# Altium schematic sheet connectors-external-old.SchDoc
size A3; DocumentNumber: 11; SheetNumber: 11; SheetTotal: 45; SheetDescription: Connectors (external)
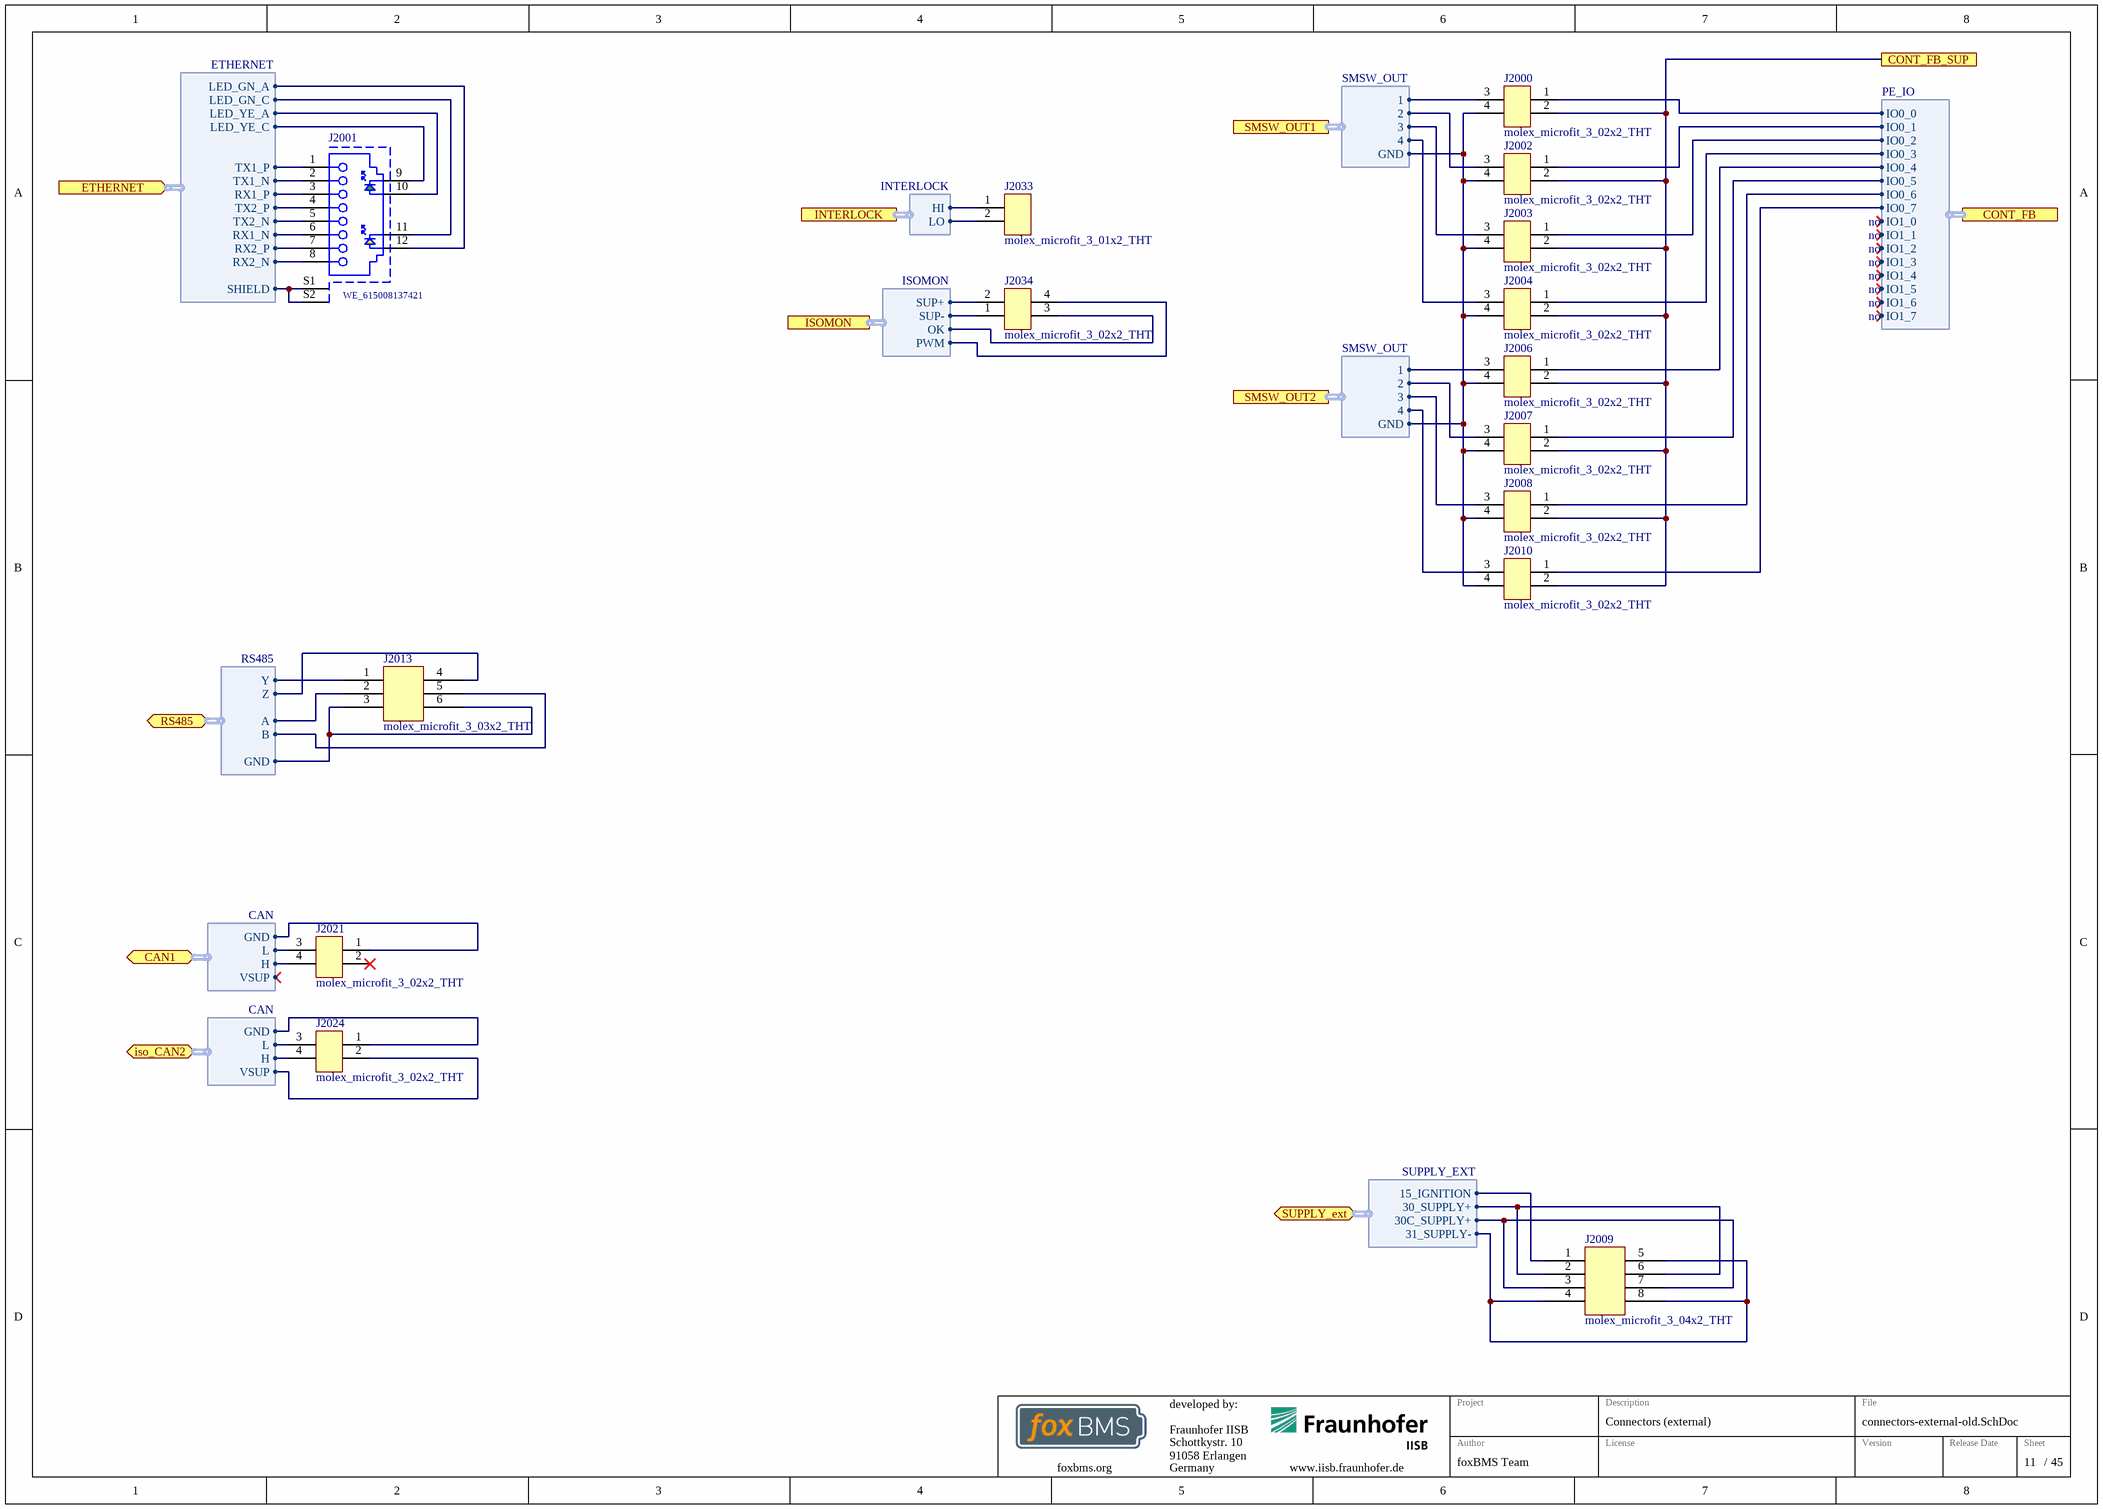
[diagram p0: connectors-external-old.SchDoc]

## Parts
J2000  molex_microfit_3_02x2_THT  [MOLEX_MICROFIT_02x2_THT]
J2001  WE_615008137421  [WE_615008137421]
J2002  molex_microfit_3_02x2_THT  [MOLEX_MICROFIT_02x2_THT]
J2003  molex_microfit_3_02x2_THT  [MOLEX_MICROFIT_02x2_THT]
J2004  molex_microfit_3_02x2_THT  [MOLEX_MICROFIT_02x2_THT]
J2006  molex_microfit_3_02x2_THT  [MOLEX_MICROFIT_02x2_THT]
J2007  molex_microfit_3_02x2_THT  [MOLEX_MICROFIT_02x2_THT]
J2008  molex_microfit_3_02x2_THT  [MOLEX_MICROFIT_02x2_THT]
J2009  molex_microfit_3_04x2_THT  [MOLEX_MICROFIT_04x2_THT]
J2010  molex_microfit_3_02x2_THT  [MOLEX_MICROFIT_02x2_THT]
J2013  molex_microfit_3_03x2_THT  [MOLEX_MICROFIT_03x2_THT]
J2021  molex_microfit_3_02x2_THT  [MOLEX_MICROFIT_02x2_THT]
J2024  molex_microfit_3_02x2_THT  [MOLEX_MICROFIT_02x2_THT]
J2033  molex_microfit_3_01x2_THT  [MOLEX_MICROFIT_01x2_THT]
J2034  molex_microfit_3_02x2_THT  [MOLEX_MICROFIT_02x2_THT]

## Ports
CAN1 (bidir, harness CAN), CONT_FB (harness PE_IO), CONT_FB_SUP, ETHERNET (in, harness ETHERNET), INTERLOCK (harness INTERLOCK), iso_CAN2 (bidir, harness CAN), ISOMON (harness ISOMON), RS485 (bidir, harness RS485), SMSW_OUT1 (harness SMSW_OUT), SMSW_OUT2 (harness SMSW_OUT), SUPPLY_ext (bidir, harness SUPPLY_EXT)

## Harnesses
RS485: Y, Z, A, B, GND
SMSW_OUT: 1, 2, 3, 4, GND
PE_IO: IO0_0, IO0_1, IO0_2, IO0_3, IO0_4, IO0_5, IO0_6, IO0_7, IO1_0, IO1_1, IO1_2, IO1_3, IO1_4, IO1_5, IO1_6, IO1_7
ISOMON: SUP+, SUP-, OK, PWM
CAN: H, L, GND, VSUP
INTERLOCK: HI, LO
ETHERNET: TX1_P, TX1_N, RX1_P, TX2_P, TX2_N, RX1_N, RX2_P, RX2_N, SHIELD, LED_YE_C, LED_YE_A, LED_GN_C, LED_GN_A
SUPPLY_EXT: 30_SUPPLY+, 31_SUPPLY-, 15_IGNITION, 30C_SUPPLY+

## Nets
CONT_FB_SUP: J2000.2 J2002.2 J2003.2 J2004.2 J2006.2 J2007.2 J2008.2 J2010.2 ; port CONT_FB_SUP
NetJ2000_1: J2000.1 ; port CONT_FB.IO0_0
NetJ2000_3: J2000.3 ; port SMSW_OUT1.1
NetJ2000_4: J2000.4 J2002.4 J2003.4 J2004.4 J2006.4 J2007.4 J2008.4 J2010.4 ; port SMSW_OUT1.GND, port SMSW_OUT2.GND
NetJ2001_1: J2001.1 ; port ETHERNET.TX1_P
NetJ2001_2: J2001.2 ; port ETHERNET.TX1_N
NetJ2001_3: J2001.3 ; port ETHERNET.RX1_P
NetJ2001_4: J2001.4 ; port ETHERNET.TX2_P
NetJ2001_5: J2001.5 ; port ETHERNET.TX2_N
NetJ2001_6: J2001.6 ; port ETHERNET.RX1_N
NetJ2001_7: J2001.7 ; port ETHERNET.RX2_P
NetJ2001_8: J2001.8 ; port ETHERNET.RX2_N
NetJ2001_9: J2001.9 ; port ETHERNET.LED_YE_C
NetJ2001_10: J2001.10 ; port ETHERNET.LED_YE_A
NetJ2001_11: J2001.11 ; port ETHERNET.LED_GN_C
NetJ2001_12: J2001.12 ; port ETHERNET.LED_GN_A
NetJ2001_S1: J2001.S1 J2001.S2 ; port ETHERNET.SHIELD
NetJ2002_1: J2002.1 ; port CONT_FB.IO0_1
NetJ2002_3: J2002.3 ; port SMSW_OUT1.2
NetJ2003_1: J2003.1 ; port CONT_FB.IO0_2
NetJ2003_3: J2003.3 ; port SMSW_OUT1.3
NetJ2004_1: J2004.1 ; port CONT_FB.IO0_3
NetJ2004_3: J2004.3 ; port SMSW_OUT1.4
NetJ2006_1: J2006.1 ; port CONT_FB.IO0_4
NetJ2006_3: J2006.3 ; port SMSW_OUT2.1
NetJ2007_1: J2007.1 ; port CONT_FB.IO0_5
NetJ2007_3: J2007.3 ; port SMSW_OUT2.2
NetJ2008_1: J2008.1 ; port CONT_FB.IO0_6
NetJ2008_3: J2008.3 ; port SMSW_OUT2.3
NetJ2009_1: J2009.1 ; port SUPPLY_ext.15_IGNITION
NetJ2009_2: J2009.2 J2009.6 ; port SUPPLY_ext.30_SUPPLY+
NetJ2009_3: J2009.3 J2009.7 ; port SUPPLY_ext.30C_SUPPLY+
NetJ2009_4: J2009.4 J2009.5 J2009.8 ; port SUPPLY_ext.31_SUPPLY-
NetJ2010_1: J2010.1 ; port CONT_FB.IO0_7
NetJ2010_3: J2010.3 ; port SMSW_OUT2.4
NetJ2013_1: J2013.1 ; port RS485.Y
NetJ2013_2: J2013.2 ; port RS485.A
NetJ2013_3: J2013.3 J2013.6 ; port RS485.GND
NetJ2013_4: J2013.4 ; port RS485.Z
NetJ2013_5: J2013.5 ; port RS485.B
NetJ2021_1: J2021.1 ; port CAN1.GND
NetJ2021_3: J2021.3 ; port CAN1.L
NetJ2021_4: J2021.4 ; port CAN1.H
NetJ2024_1: J2024.1 ; port iso_CAN2.GND
NetJ2024_2: J2024.2 ; port iso_CAN2.VSUP
NetJ2024_3: J2024.3 ; port iso_CAN2.L
NetJ2024_4: J2024.4 ; port iso_CAN2.H
NetJ2033_1: J2033.1 ; port INTERLOCK.HI
NetJ2033_2: J2033.2 ; port INTERLOCK.LO
NetJ2034_1: J2034.1 ; port ISOMON.SUP-
NetJ2034_2: J2034.2 ; port ISOMON.SUP+
NetJ2034_3: J2034.3 ; port ISOMON.OK
NetJ2034_4: J2034.4 ; port ISOMON.PWM

Not connected (* = marked no-connect by the designer): J2021 2*

## Notes on the sheet
- not used
- Fraunhofer IISB
- Schottkystr. 10
- developed by:
- 91058 Erlangen
- Germany
- Author
- Project
- License
- Description
- File
- Version
- Release Date
- Sheet
- foxbms.org <https://foxbms.org>
- www.iisb.fraunhofer.de <https://www.iisb.fraunhofer.de/>
- foxBMS Team
- /

## Library data of the parts
J2000 J2002-J2004 J2006-J2008 J2010 J2021 J2024 J2034 = molex_microfit_3_02x2_THT: Micro-Fit 3.0 Right Angle Header, 3.00mm Pitch, Dual Row, 4 Circuits, with Snap-in Plastic Peg PCB Lock, Tin, Glow Wire Capable, Black, 43045-0400; Manufacturer: Molex; Circuits: 4; Rated Voltage: 600V; Rated Current: 8.5A; Automotive Qualified: False; Part Number: molex_microfit_3_02x2_THT; Part Name: MicroFit; Operating Temperature: -40°C - +105°C; Supplier 1: Farnell; Supplier Part Number 1: 9733019; ECCN: EAR99
J2001 = WE_615008137421: Modular Jack WR-MJ, Tab Up; Manufacturer: Würth; Pin Number: 8P8C; Port: 1x1; Entrance: Horizontal; Compliance: Lead free / RoHS; Rated Current: 1.5 A; Working Voltage: 125 VAC; Withstanding Voltage: 1000 VAC; Contact Resistance: 30 mOhm; Circuits: 12; Rated Voltage: 120V AC; Automotive Qualified: False; ComponentLink1Description: Datasheet; ComponentLink1URL: https://www.we-online.com/katalog/datasheet/615008137421.pdf; ComponentLink2Description: Datasheet; ComponentLink2URL: https://katalog.we-online.de/em/datasheet/615008185121.pdf; Part Number: WE_615008137421; Published Date: July 2018; Publisher: Wurth Elektronik; Operating Temperature: −40 °C - +85 °C; Mounting Technology: THT; Packaging: Tray; Part Name: WE_615008137421; Supplier 1: Mouser; Supplier Part Number 1: 710-615008137421; Supplier 3: Wuerth Electronics; Supplier Part Number 3: 615008137421; ECCN: EAR99
J2009 = molex_microfit_3_04x2_THT: Micro-Fit 3.0 Right Angle Header, 3.00mm Pitch, Dual Row, 8 Circuits, with Snap-in Plastic Peg PCB Lock, Tin, Glow Wire Capable, Black, 43045-0800; Manufacturer: Molex; Circuits: 8; Rated Voltage: 600V; Rated Current: 8.5A; Automotive Qualified: False; Part Number: molex_microfit_3_04x2_THT; Part Name: MicroFit; Operating Temperature: -40°C - +105°C; Supplier 1: Farnell; Supplier Part Number 1: 1012254; ECCN: EAR99
J2013 = molex_microfit_3_03x2_THT: Micro-Fit 3.0 Right Angle Header, 3.00mm Pitch, Dual Row, 6 Circuits, with Snap-in Plastic Peg PCB Lock, Tin, Glow Wire Capable, Black, 43045-0600; Manufacturer: Molex; Circuits: 6; Rated Voltage: 600V; Rated Current: 8.5A; Automotive Qualified: False; Part Number: molex_microfit_3_03x2_THT; Part Name: MicroFit; Operating Temperature: -40°C - +105°C; Supplier 1: Farnell; Supplier Part Number 1: 1012252; ECCN: EAR99
J2033 = molex_microfit_3_01x2_THT: Micro-Fit 3.0 Right Angle Header, 3.00mm Pitch, Dual Row, 2 Circuits, with Snap-in Plastic Peg PCB Lock, Tin, Glow Wire Capable, Black, 43045-0200; Manufacturer: Molex; Circuits: 2; Rated Voltage: 600V; Rated Current: 8.5A; Automotive Qualified: False; Part Number: molex_microfit_3_01x2_THT; Part Name: MicroFit; Operating Temperature: -40°C - +105°C; Supplier 1: Farnell; Supplier Part Number 1: 1012251; ECCN: EAR99